# EAGLE design monitor (EAGLE 6.3)

## Sheet 1 of 4: Measure
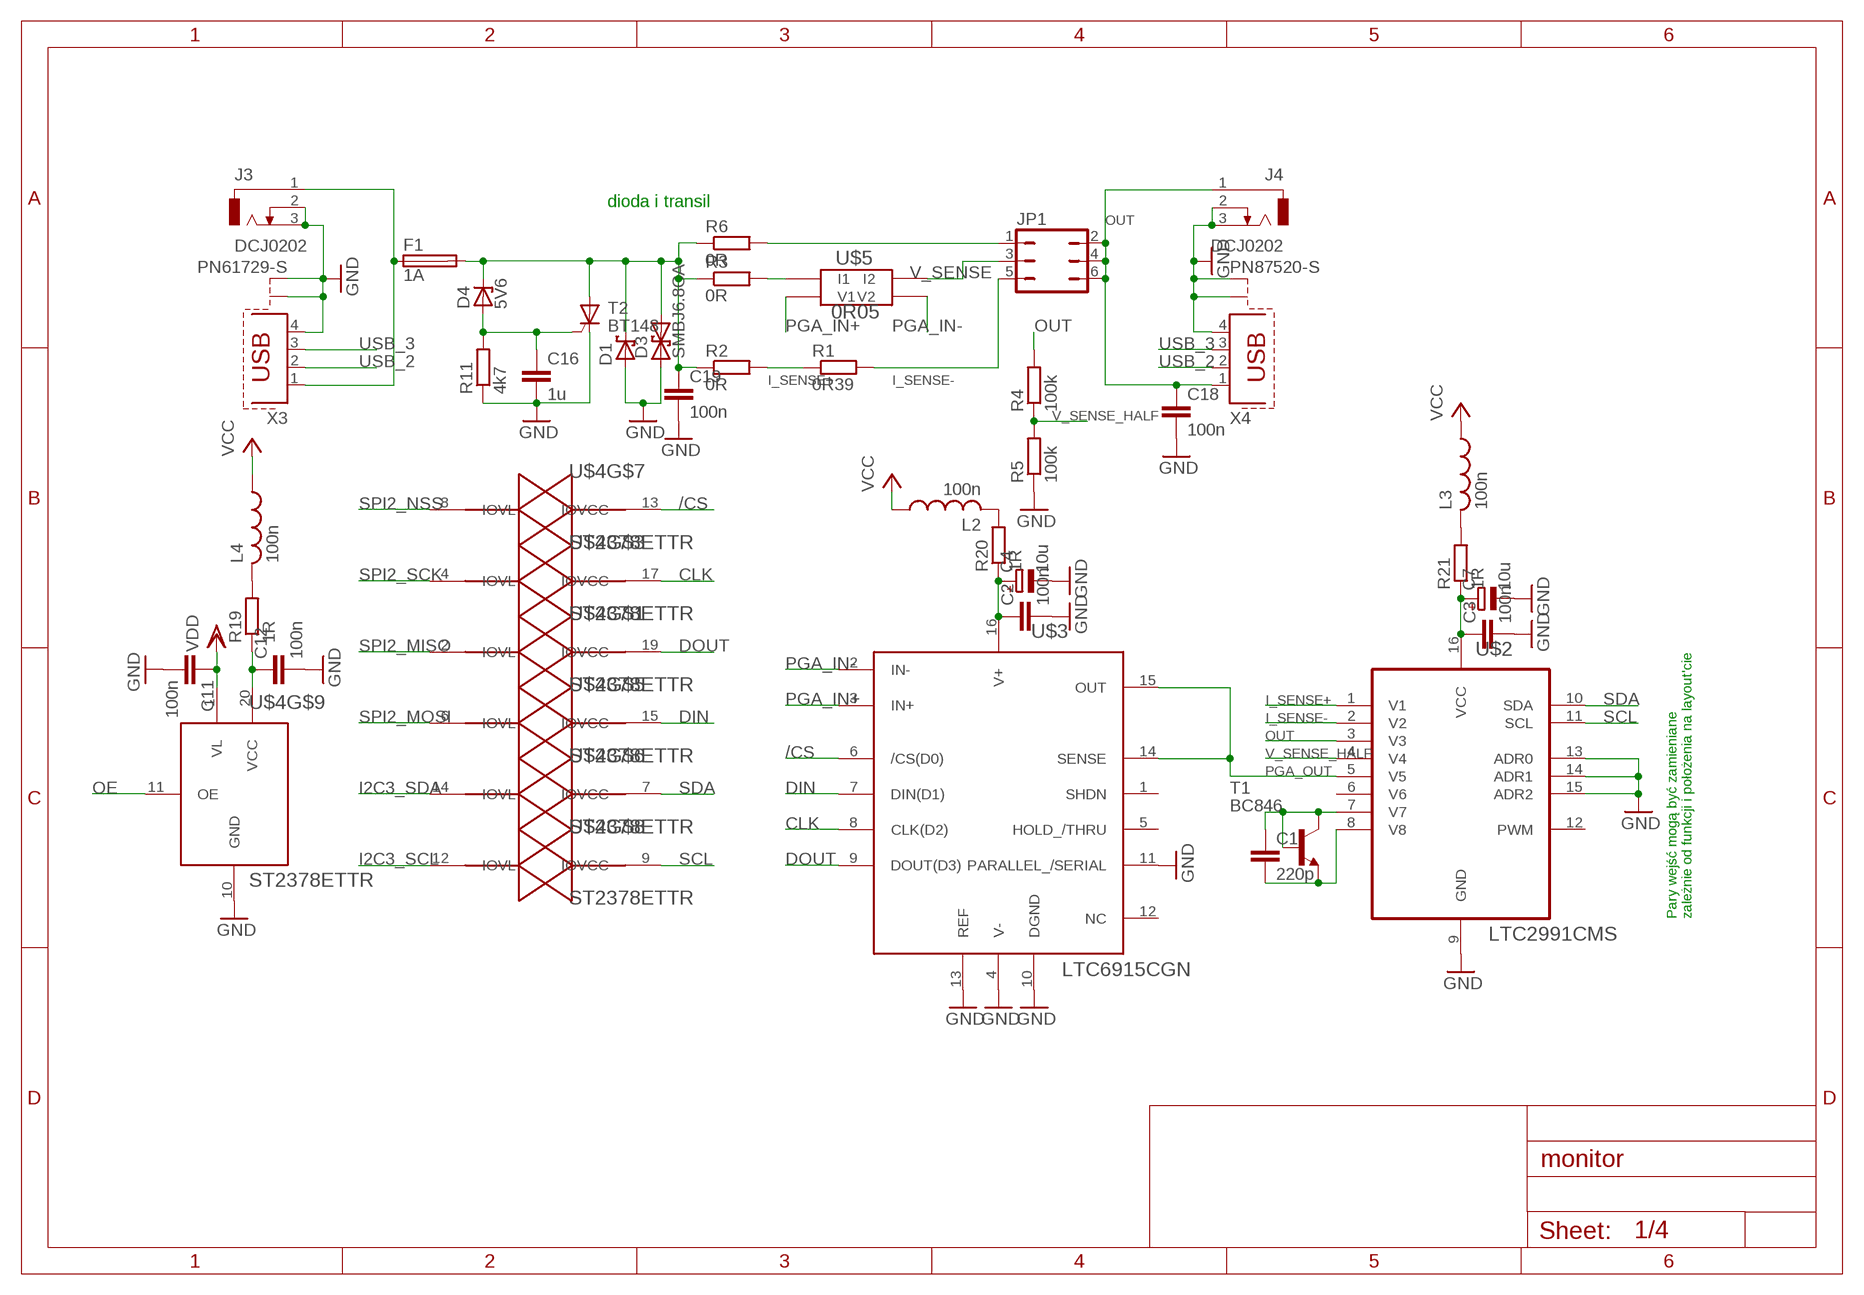
[diagram p0: schematic, sheet 1]

### Parts
C1  220p  C-EUC0805  [C0805]
C2  100n  C-EUC0603  [C0603]
C3  100n  C-EUC0603  [C0603]
C4  10u  CPOL-EUSMCA  [SMC_A]
C7  10u  CPOL-EUSMCA  [SMC_A]
C11  100n  C-EUC0603  [C0603]
C12  100n  C-EUC0603  [C0603]
C16  1u  C-EUC0805  [C0805]
C18  100n  C-EUC0603  [C0603]
C19  100n  C-EUC0603  [C0603]
D1  SCHOTTKY-DIODESMD  [SMB]
D3  SMBJ6.8CA  SMBJ  [SMB]
D4  5V6  ZENER-DIODESOD80C  [SOD80C]
F1  1A  FUSE1206  [R1206]
J3  DCJ0202  [DCJ0202]
J4  DCJ0202  [DCJ0202]
JP1  JP3Q  [JP3Q]
L2  100n  L-US  [R0603]
L3  100n  L-US  [R0603]
L4  100n  L-US  [R0603]
R1  0R39  R-EU_0207/7  [0207/7]
R2  0R  R-EU_R0805  [R0805]
R3  0R  R-EU_R0805  [R0805]
R4  100k  R-EU_R0805  [R0805]
R5  100k  R-EU_R0805  [R0805]
R6  0R  R-EU_R0805  [R0805]
R11  4k7  R-EU_R0805  [R0805]
R19  1R  R-EU_R0603  [R0603]
R20  1R  R-EU_R0603  [R0603]
R21  1R  R-EU_R0603  [R0603]
T1  BC846  [SOT23]
T2  BT148  [SOT223]
U$2  LTC2991CMS  [SOP50P490X110-16N]
U$3  LTC6915CGN  [SOP65P640X120-16N]
U$4  ST2378ETTR  [TSSOP20]
U$5  0R05  LVK12R050DER  [LVK12]
X3  PN61729-S  [PN61729-S]
X4  PN87520-S  [PN87520-S]

### Nets
/CS: U$3.6(/CS(D0)) U$4.13(IOVCC)
CLK: U$3.8(CLK(D2)) U$4.17(IOVCC)
DIN: U$3.7(DIN(D1)) U$4.15(IOVCC)
DOUT: U$3.9(DOUT(D3)) U$4.19(IOVCC)
GND: C2.2 C3.2 C4.- C7.- C11.2 C12.2 C16.2 C18.2 C19.2 D1.A D3.A J3.2 J3.3 J4.2 J4.3 R5.1 R11.1 T2.1(C) U$2.9(GND) U$2.13(ADR0) U$2.14(ADR1) U$2.15(ADR2) U$3.4(V-) U$3.10(DGND) U$3.11(PARALLEL_/SERIAL) U$3.13(REF) U$4.10(GND) X3.4 X3.S1 X3.S2 X4.4 X4.S1 X4.S2 ; also sheet 2,3,4
I2C3_SCL: U$4.12(IOVL) ; also sheet 2
I2C3_SDA: U$4.14(IOVL) ; also sheet 2
I_SENSE+: R1.1 R2.2 U$2.1(V1)
I_SENSE-: JP1.5 R1.2 U$2.2(V2)
IN: F1.1 J3.1 X3.1
N$2: R3.2 U$5.P$3(I1)
N$4: JP1.1 R6.2
N$13: C19.1 D1.C D3.C D4.C F1.2 R2.1 R3.1 R6.1 T2.2(A)
N$14: C1.1 T1.1(B) T1.3(C) U$2.7(V7)
N$15: C1.2 T1.2(E) U$2.8(V8)
N$23: C16.1 D4.A R11.2 T2.3(G)
N$27: C12.1 R19.1 U$4.20(VCC)
N$30: L4.2 R19.2
N$31: C2.1 C4.+ R20.1 U$3.16(V+)
N$32: C3.1 C7.+ R21.1 U$2.16(VCC)
N$33: L2.2 R20.2
N$35: L3.2 R21.2
OE: U$4.11(OE) ; also sheet 2
OUT: C18.1 J4.1 JP1.2 JP1.4 JP1.6 R4.2 U$2.3(V3) X4.1
PGA_IN+: U$3.3(IN+) U$5.P$4(V1)
PGA_IN-: U$3.2(IN-) U$5.P$1(V2)
PGA_OUT: U$2.5(V5) U$3.14(SENSE) U$3.15(OUT)
SCL: U$2.11(SCL) U$4.9(IOVCC)
SDA: U$2.10(SDA) U$4.7(IOVCC)
SPI2_MISO: U$4.2(IOVL) ; also sheet 2
SPI2_MOSI: U$4.6(IOVL) ; also sheet 2
SPI2_NSS: U$4.8(IOVL) ; also sheet 2
SPI2_SCK: U$4.4(IOVL) ; also sheet 2
USB_2: X3.2 X4.2
USB_3: X3.3 X4.3
V_SENSE: JP1.3 U$5.P$2(I2)
V_SENSE_HALF: R4.1 R5.2 U$2.4(V4)
VCC: L2.1 L3.1 L4.1 ; also sheet 3
VDD: C11.1 U$4.1(VL) ; also sheet 2
Unconnected: U$2.6(V6) U$2.12(PWM) U$3.1(SHDN) U$3.5(HOLD_/THRU) U$3.12(NC) U$4.3(IOVCC) U$4.5(IOVCC) U$4.16(IOVL) U$4.18(IOVL)

### Notes on the sheet
- dioda i transil
- Pary wejść mogą być zamieniane 
  zależnie od funkcji i położenia na layout'cie

## Sheet 2 of 4: Proc
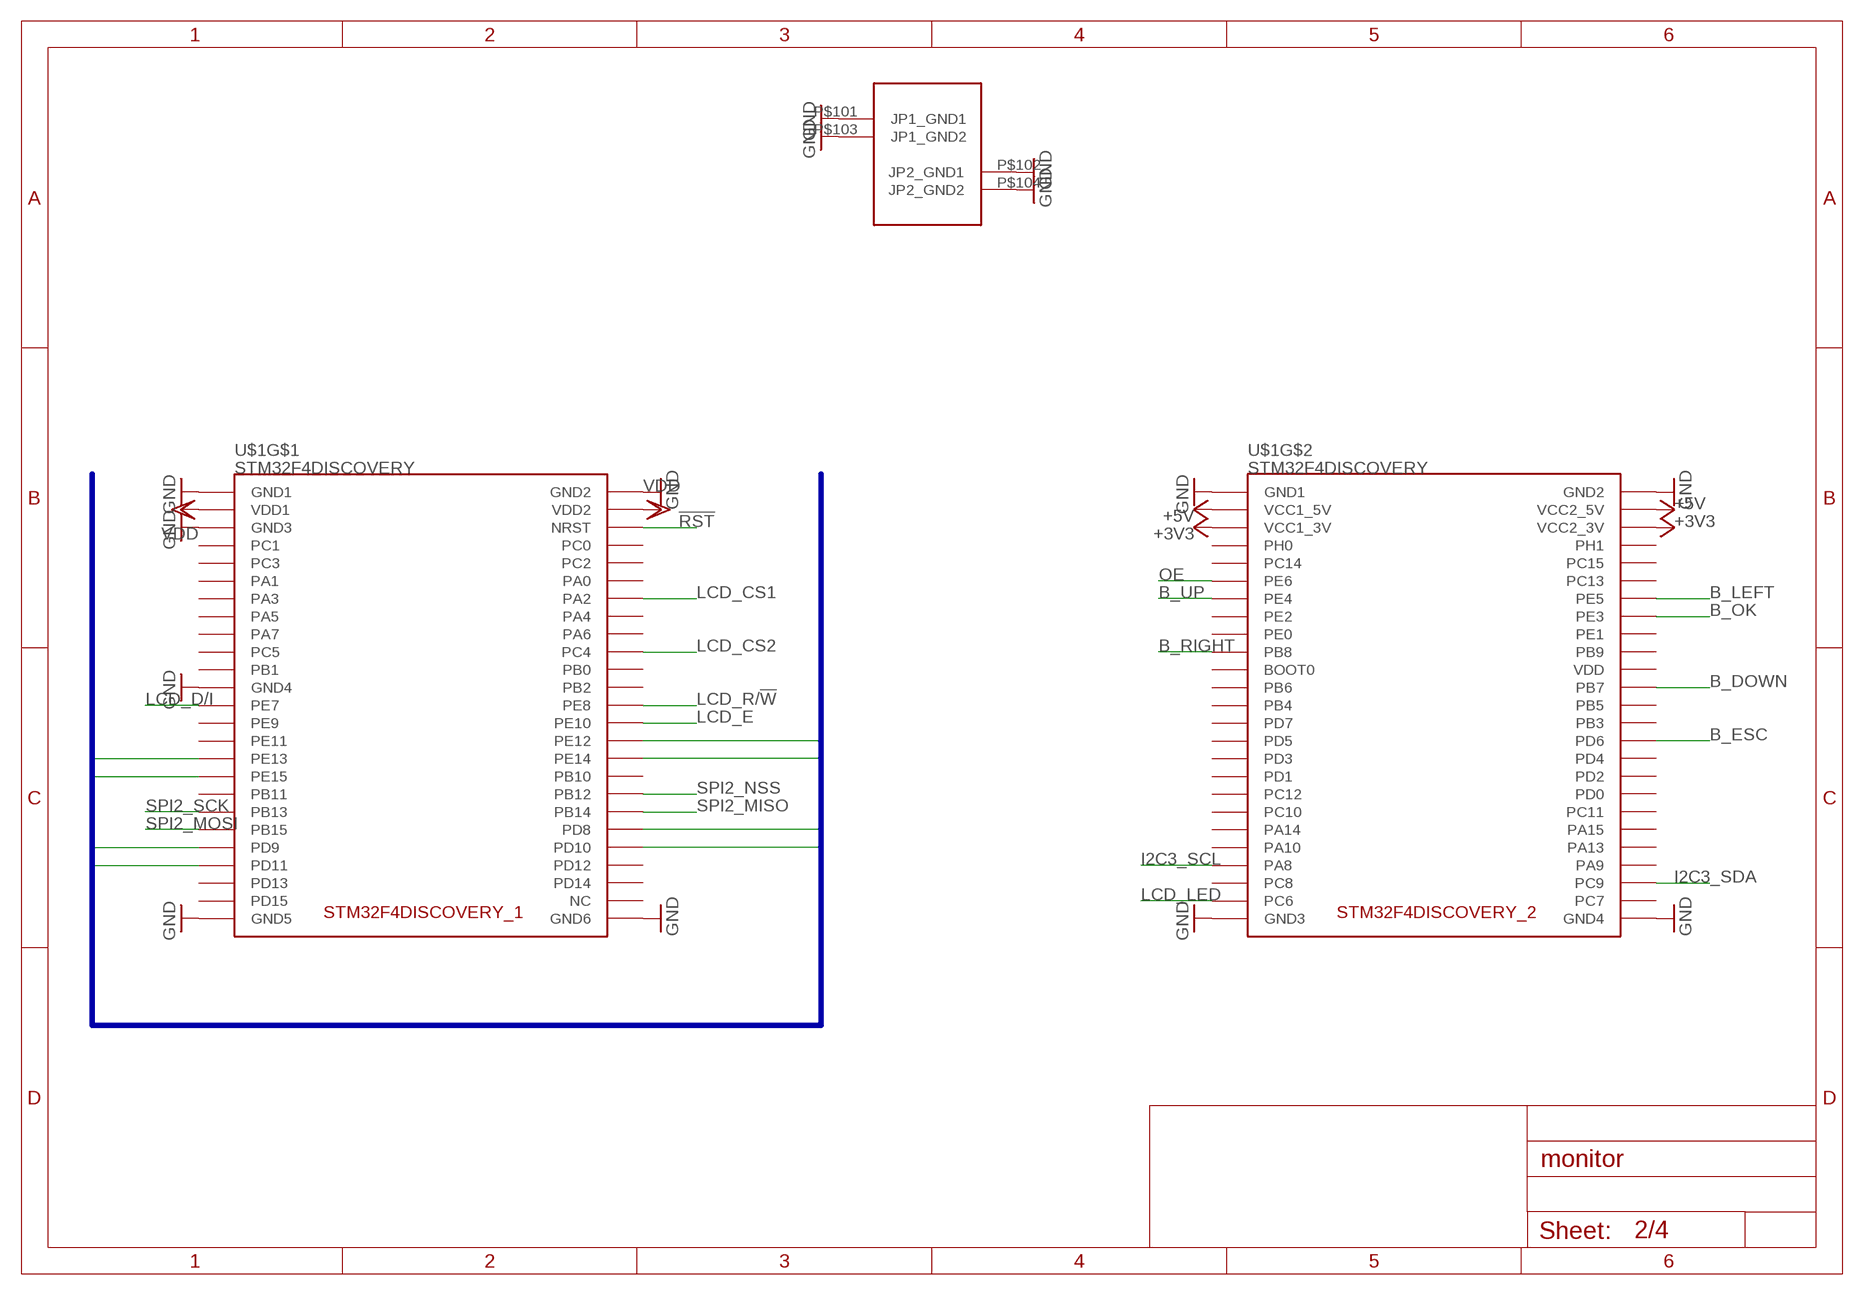
[diagram p1: schematic, sheet 2]

### Parts
U$1  STM32F4DISCOVERY  [STM32F4DISCOVERY]

### Nets
!RST: U$1.P$6(NRST) ; also sheet 4
+3V3: U$1.P$55(VCC1_3V) U$1.P$56(VCC2_3V)
+5V: U$1.P$53(VCC1_5V) U$1.P$54(VCC2_5V) ; also sheet 3,4
B_DOWN: U$1.P$74(PB7) ; also sheet 4
B_ESC: U$1.P$80(PD6) ; also sheet 4
B_LEFT: U$1.P$64(PE5) ; also sheet 4
B_OK: U$1.P$66(PE3) ; also sheet 4
B_RIGHT: U$1.P$69(PB8) ; also sheet 4
B_UP: U$1.P$63(PE4) ; also sheet 4
GND: U$1.P$1(GND1) U$1.P$2(GND2) U$1.P$5(GND3) U$1.P$23(GND4) U$1.P$49(GND5) U$1.P$50(GND6) U$1.P$51(GND1) U$1.P$52(GND2) U$1.P$99(GND3) U$1.P$100(GND4) U$1.P$101(JP1_GND1) U$1.P$102(JP2_GND1) U$1.P$103(JP1_GND2) U$1.P$104(JP2_GND2) ; also sheet 1,3,4
I2C3_SCL: U$1.P$93(PA8) ; also sheet 1
I2C3_SDA: U$1.P$96(PC9) ; also sheet 1
LCD_CS1: U$1.P$14(PA2) ; also sheet 4
LCD_CS2: U$1.P$20(PC4) ; also sheet 4
LCD_D0: U$1.P$30(PE12) ; also sheet 4
LCD_D1: U$1.P$31(PE13) ; also sheet 4
LCD_D2: U$1.P$32(PE14) ; also sheet 4
LCD_D3: U$1.P$33(PE15) ; also sheet 4
LCD_D4: U$1.P$40(PD8) ; also sheet 4
LCD_D5: U$1.P$41(PD9) ; also sheet 4
LCD_D6: U$1.P$42(PD10) ; also sheet 4
LCD_D7: U$1.P$43(PD11) ; also sheet 4
LCD_D/I: U$1.P$25(PE7) ; also sheet 4
LCD_E: U$1.P$28(PE10) ; also sheet 4
LCD_LED: U$1.P$97(PC6) ; also sheet 4
LCD_R/!W: U$1.P$26(PE8) ; also sheet 4
OE: U$1.P$61(PE6) ; also sheet 1
SPI2_MISO: U$1.P$38(PB14) ; also sheet 1
SPI2_MOSI: U$1.P$39(PB15) ; also sheet 1
SPI2_NSS: U$1.P$36(PB12) ; also sheet 1
SPI2_SCK: U$1.P$37(PB13) ; also sheet 1
VDD: U$1.P$3(VDD1) U$1.P$4(VDD2) ; also sheet 1
Unconnected: U$1.P$7(PC1) U$1.P$8(PC0) U$1.P$9(PC3) U$1.P$10(PC2) U$1.P$11(PA1) U$1.P$12(PA0) U$1.P$13(PA3) U$1.P$15(PA5) U$1.P$16(PA4) U$1.P$17(PA7) U$1.P$18(PA6) U$1.P$19(PC5) U$1.P$21(PB1) U$1.P$22(PB0) U$1.P$24(PB2) U$1.P$27(PE9) U$1.P$29(PE11) U$1.P$34(PB10) U$1.P$35(PB11) U$1.P$44(PD12) U$1.P$45(PD13) U$1.P$46(PD14) U$1.P$47(PD15) U$1.P$48(NC) U$1.P$57(PH0) U$1.P$58(PH1) U$1.P$59(PC14) U$1.P$60(PC15) U$1.P$62(PC13) U$1.P$65(PE2) U$1.P$67(PE0) U$1.P$68(PE1) U$1.P$70(PB9) U$1.P$71(BOOT0) U$1.P$72(VDD) U$1.P$73(PB6) U$1.P$75(PB4) U$1.P$76(PB5) U$1.P$77(PD7) U$1.P$78(PB3) U$1.P$79(PD5) U$1.P$81(PD3) U$1.P$82(PD4) U$1.P$83(PD1) U$1.P$84(PD2) U$1.P$85(PC12) U$1.P$86(PD0) U$1.P$87(PC10) U$1.P$88(PC11) U$1.P$89(PA14) U$1.P$90(PA15) U$1.P$91(PA10) U$1.P$92(PA13) U$1.P$94(PA9) U$1.P$95(PC8) U$1.P$98(PC7)

### Buses
LCD_D[0..7]

## Sheet 3 of 4: Supply
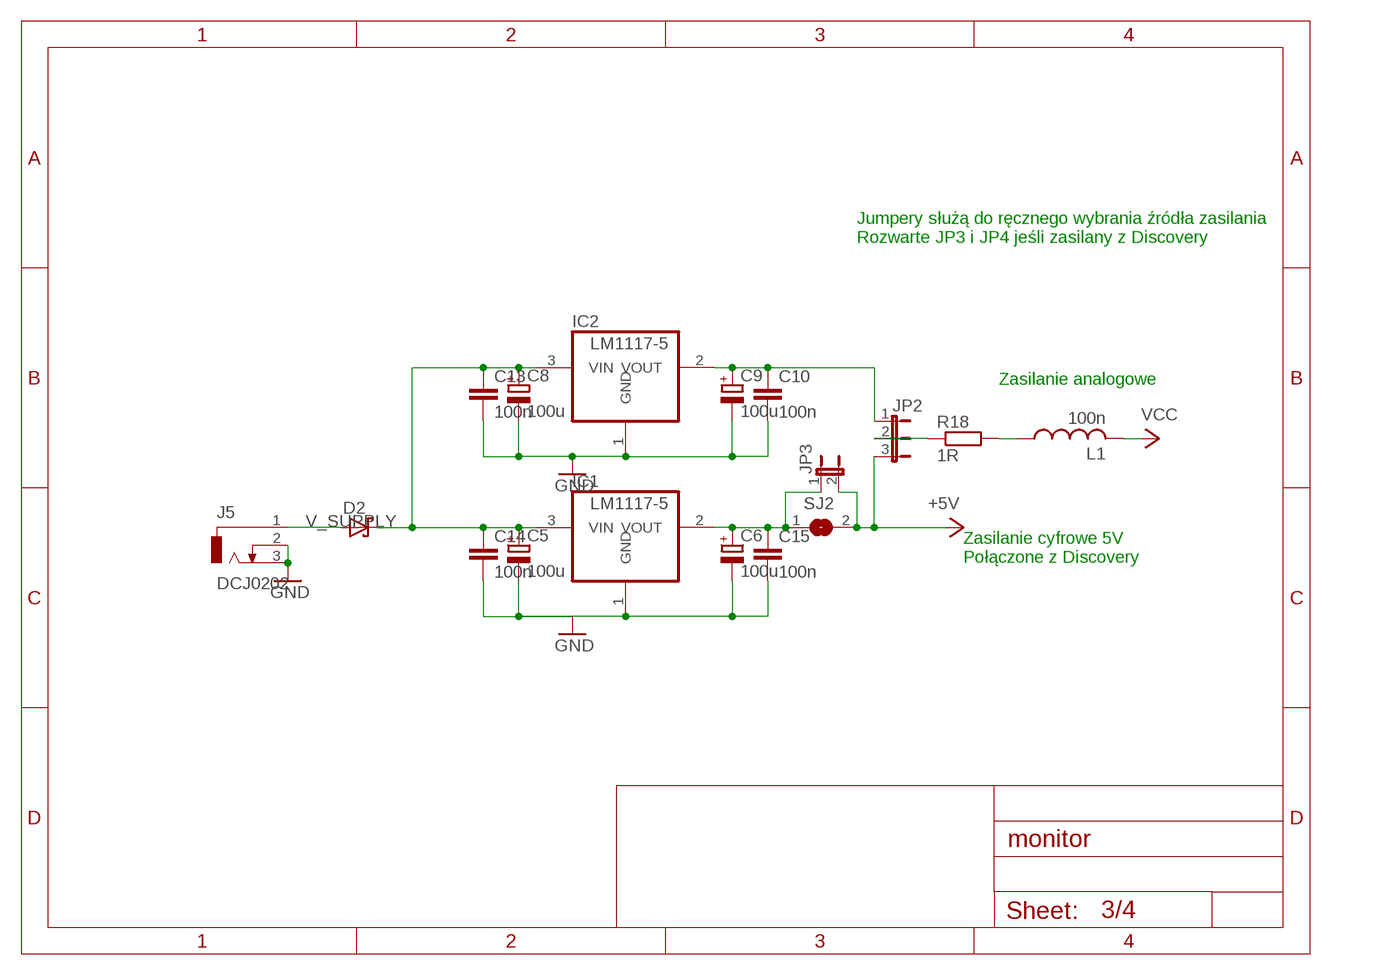
[diagram p2: schematic, sheet 3]

### Parts
C5  100u  CPOL-EUSMCB  [SMC_B]
C6  100u  CPOL-EUSMCB  [SMC_B]
C8  100u  CPOL-EUSMCB  [SMC_B]
C9  100u  CPOL-EUSMCB  [SMC_B]
C10  100n  C-EUC0603  [C0603]
C13  100n  C-EUC0603  [C0603]
C14  100n  C-EUC0603  [C0603]
C15  100n  C-EUC0603  [C0603]
D2  SCHOTTKY-DIODESMD  [SMB]
IC1  LM1117-5  REG1117  [SOT223]
IC2  LM1117-5  REG1117  [SOT223]
J5  DCJ0202  [DCJ0202]
JP2  JP2E  [JP2]
JP3  JP1E  [JP1]
L1  100n  L-US  [R0603]
R18  1R  R-EU_R0603  [R0603]
SJ2  SJ  [SJ]

### Nets
+5V: JP2.3 JP3.2 SJ2.2 ; also sheet 2,4
GND: C5.- C6.- C8.- C9.- C10.2 C13.2 C14.2 C15.2 IC1.1(GND) IC2.1(GND) J5.2 J5.3 ; also sheet 1,2,4
N$8: C6.+ C15.1 IC1.2(VOUT) JP3.1 SJ2.1
N$10: C9.+ C10.1 IC2.2(VOUT) JP2.1
N$11: D2.A J5.1
N$24: L1.1 R18.2
N$25: JP2.2 R18.1
V_SUPPLY: C5.+ C8.+ C13.1 C14.1 D2.C IC1.3(VIN) IC2.3(VIN)
VCC: L1.2 ; also sheet 1

### Notes on the sheet
- Jumpery służą do ręcznego wybrania źródła zasilania
  Rozwarte JP3 i JP4 jeśli zasilany z Discovery
- Zasilanie analogowe
- Zasilanie cyfrowe 5V
  Połączone z Discovery

## Sheet 4 of 4: User
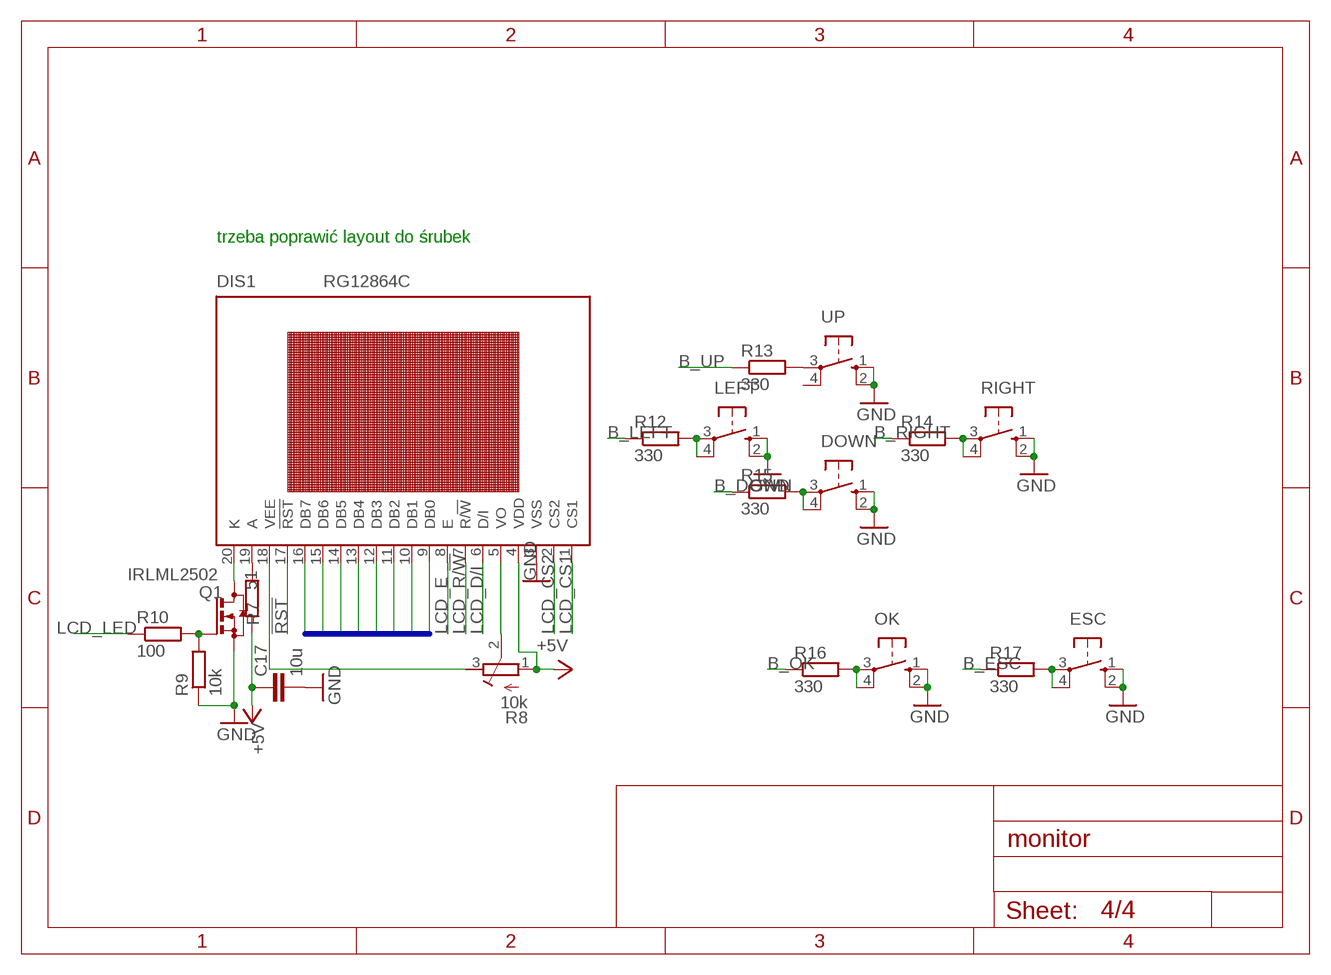
[diagram p3: schematic, sheet 4]

### Parts
C17  10u  C-EUC1206  [C1206]
DIS1  RG12864C  [RG12864C]
DOWN  40-XX  [B3F-40XX]
ESC  40-XX  [B3F-40XX]
LEFT  40-XX  [B3F-40XX]
OK  40-XX  [B3F-40XX]
Q1  IRLML2502  BSS123  [SOT23]
R7  51  R-EU_R1206  [R1206]
R8  10k  TS53YJ  [RTRIMTS53YJ]
R9  10k  R-EU_R0805  [R0805]
R10  100  R-EU_R0805  [R0805]
R12  330  R-EU_R0805  [R0805]
R13  330  R-EU_R0805  [R0805]
R14  330  R-EU_R0805  [R0805]
R15  330  R-EU_R0805  [R0805]
R16  330  R-EU_R0805  [R0805]
R17  330  R-EU_R0805  [R0805]
RIGHT  40-XX  [B3F-40XX]
UP  40-XX  [B3F-40XX]

### Nets
!RST: DIS1.17(!RST) ; also sheet 2
+5V: C17.1 DIS1.4(VDD) R7.1 R8.1(A) ; also sheet 2,3
B_DOWN: R15.1 ; also sheet 2
B_ESC: R17.1 ; also sheet 2
B_LEFT: R12.1 ; also sheet 2
B_OK: R16.1 ; also sheet 2
B_RIGHT: R14.1 ; also sheet 2
B_UP: R13.1 ; also sheet 2
GND: C17.2 DIS1.3(VSS) DOWN.1(S) DOWN.2(S1) ESC.1(S) ESC.2(S1) LEFT.1(S) LEFT.2(S1) OK.1(S) OK.2(S1) Q1.2(S) R9.1 RIGHT.1(S) RIGHT.2(S1) UP.1(S) UP.2(S1) ; also sheet 1,2,3
LCD_CS1: DIS1.1(CS1) ; also sheet 2
LCD_CS2: DIS1.2(CS2) ; also sheet 2
LCD_D0: DIS1.9(DB0) ; also sheet 2
LCD_D1: DIS1.10(DB1) ; also sheet 2
LCD_D2: DIS1.11(DB2) ; also sheet 2
LCD_D3: DIS1.12(DB3) ; also sheet 2
LCD_D4: DIS1.13(DB4) ; also sheet 2
LCD_D5: DIS1.14(DB5) ; also sheet 2
LCD_D6: DIS1.15(DB6) ; also sheet 2
LCD_D7: DIS1.16(DB7) ; also sheet 2
LCD_D/I: DIS1.6(D/I) ; also sheet 2
LCD_E: DIS1.8(E) ; also sheet 2
LCD_LED: R10.1 ; also sheet 2
LCD_R/!W: DIS1.7(R/!W) ; also sheet 2
N$1: DIS1.19(A) R7.2
N$3: DIS1.18(VEE) R8.3(E)
N$6: DIS1.5(VO) R8.2(S)
N$7: LEFT.3(P) LEFT.4(P1) R12.2
N$9: DIS1.20(K) Q1.3(D)
N$12: Q1.1(G) R9.2 R10.2
N$17: R13.2 UP.3(P)
N$18: R14.2 RIGHT.3(P) RIGHT.4(P1)
N$19: DOWN.3(P) DOWN.4(P1) R15.2
N$20: ESC.3(P) ESC.4(P1) R17.2
N$21: OK.3(P) OK.4(P1) R16.2
Unconnected: UP.4(P1)

### Buses
LCD_D[0..7]

### Notes on the sheet
- trzeba poprawić layout do śrubek

## Library data of the parts
C1-C3 C10-C19 = rcl:C-EU: CAPACITOR, European symbol
C4-C9 = rcl:CPOL-EU: POLARIZED CAPACITOR, European symbol
D1 D2 = diode:SCHOTTKY-DIODE: Schottky Diode
D3 = mgr_components:SMBJ: DIODE transient-voltage suppressor
D4 = diode:ZENER-DIODE: Z-Diode
DIS1 = mgr_components:RG12864C: RG12864C 128 X 64 Dots Graphic Source: http://www.raystar-optronics.com/; OC_FARNELL: unknown; OC_NEWARK: unknown
DOWN ESC LEFT OK RIGHT UP = switch-omron:40-XX: OMRON SWITCH; MF: OMRON COMPONENTS USA; MPN: B3F-4000; OC_FARNELL: 176434; OC_NEWARK: 36K3105
F1 = fuse:FUSE: Fuse
IC1 IC2 = burr-brown:REG1117: 800mA and 1A Low Dropout (LDO) Positive Regulator 1.8V, 2.5V, 2.85V, 3.3V, 5V, and Adj; MPN: REG1117; OC_FARNELL: 1097566; OC_NEWARK: 14P6981
J3-J5 = con-jack:DCJ0202: DC POWER JACK Source: DCJ0202.pdf; OC_FARNELL: unknown; OC_NEWARK: unknown
JP1 = jumper:JP3Q: JUMPER
JP2 = jumper:JP2E: JUMPER
JP3 = jumper:JP1E: JUMPER
L1-L4 = rcl:L-US: INDUCTOR, American symbol
Q1 = transistor-small-signal:BSS123: N-CHANNEL MOS FET
R1 = resistor:R-EU_: RESISTOR, European symbol
R2-R7 R9-R21 = rcl:R-EU_: RESISTOR, European symbol
R8 = mgr_components:TS53YJ
SJ2 = jumper:SJ: SMD solder JUMPER
T1 = transistor-neu-to92:BC846: NPN TRANSISTOR
T2 = mgr_components:BT148: THYRISTOR
U$1 = stm32f4discovery:STM32F4DISCOVERY
U$2 = mgr_components:LTC2991CMS
U$3 = mgr_components:LTC6915CGN: PGA
U$4 = mgr_components:ST2378ETTR
U$5 = mgr_components:LVK12R050DER
X3 = usb:PN61729-S: BERG USB connector; OC_FARNELL: unknown; OC_NEWARK: unknown
X4 = usb:PN87520-S; OC_FARNELL: unknown; OC_NEWARK: unknown

## Board
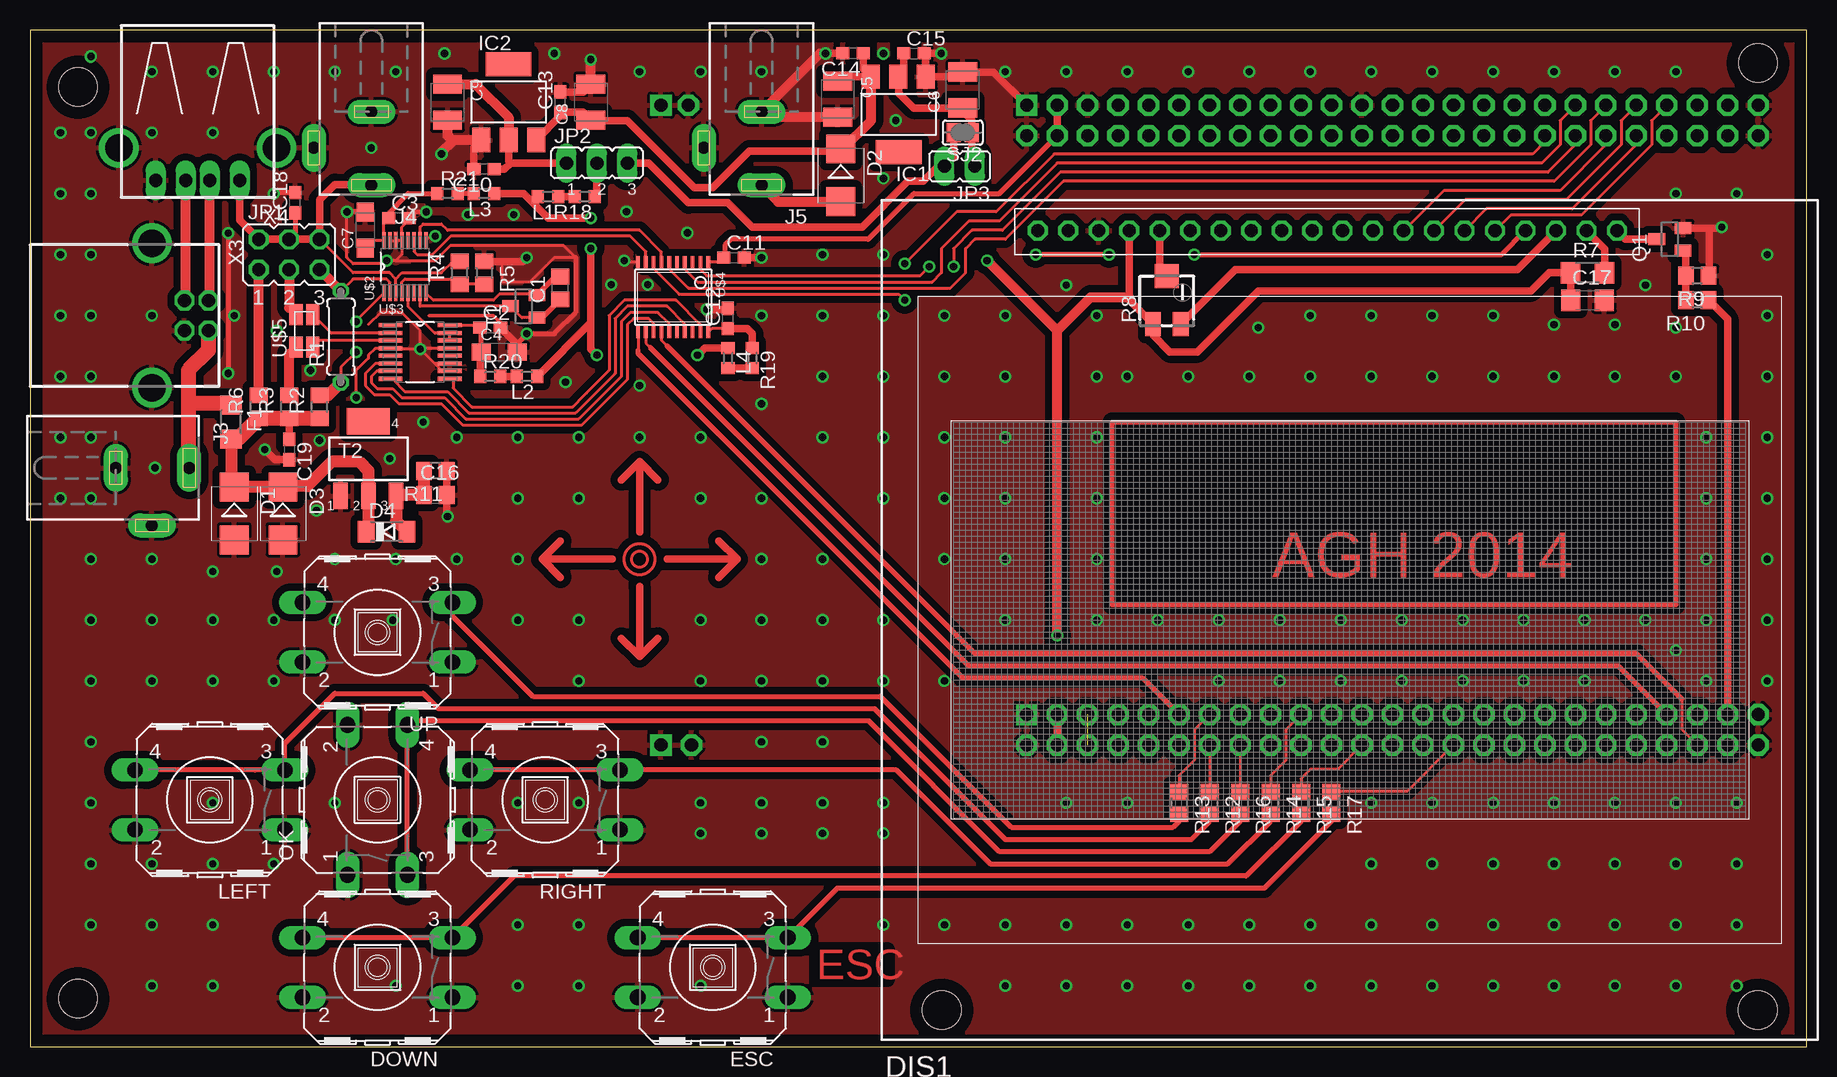
[diagram p4: board, top side]
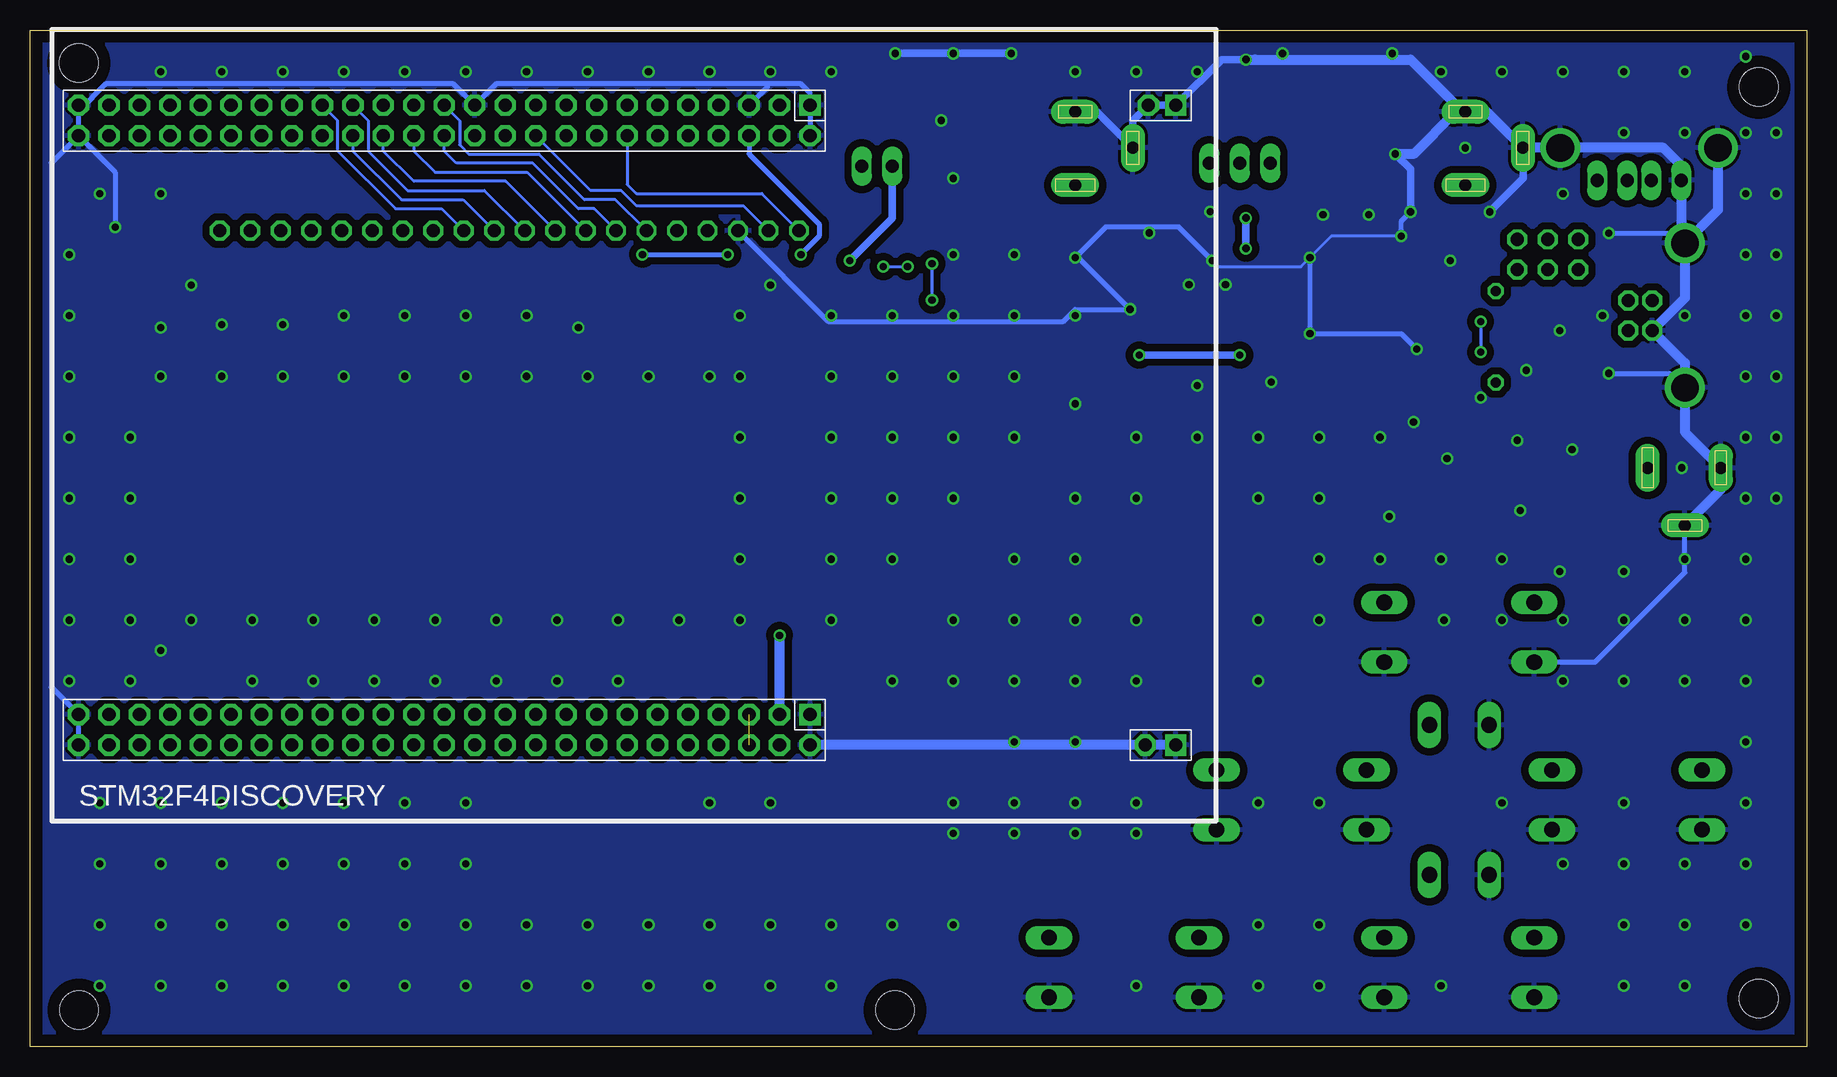
[diagram p5: board, bottom side, seen from below]

Size 148.06 x 84.76 mm. Coordinates in mm from the lower left corner, seen from the top.
Outline: 0,0 148.06,0 148.06,84.76 0,84.76 0,0
Copper layers (1*16): Top 0.035mm / dielectric 1.5mm / Bottom 0.035mm
Design rules "default *": minimum track width 10mil, minimum drill 12mil, track to track 10mil, track to pad 10mil, pad to pad 10mil, via to via 10mil, smd to smd 4mil, copper to edge 40mil, drill to drill 8mil, minimum pad ring 10mil, minimum via ring 8mil, stop-mask expansion 4mil, vias tented up to drill 0mil, thermal gap 10mil
Holes 3.2 mm at 4,80 4,4 144,82

### Footprints (pad centres in the part's own frame; a part is rotated, then mirrored left to right if it is on the bottom)
C0805 = smd 1.3 x 1.5: 1 -0.95,0; 2 0.95,0
C0603 = smd 1.1 x 1: 1 -0.85,0; 2 0.85,0
SMC_A = smd 1.6 x 1.4: + -1.5,0; - 1.5,0
SMC_B = smd 1.6 x 2.4: + -1.5,0; - 1.5,0
C1206 = smd 1.6 x 1.8: 1 -1.4,0; 2 1.4,0
SMB = smd 2.4 x 2.4: A 2.2,0; C -2.2,0
SOD80C = smd 1.4 x 1.8: A 1.7,0; C -1.7,0
RG12864C = drill 1.1 octagon: 1 -26,32.46; 2 -23.46,32.46; 3 -20.92,32.46; 4 -18.38,32.46; 5 -15.84,32.46; 6 -13.3,32.46; 7 -10.76,32.46; 8 -8.22,32.46; 9 -5.68,32.46; 10 -3.14,32.46; 11 -0.6,32.46; 12 1.94,32.46; 13 4.48,32.46; 14 7.02,32.46; 15 9.56,32.46; 16 12.1,32.46; 17 14.64,32.46; 18 17.18,32.46; 19 19.72,32.46; 20 22.26,32.46 | hole 3.2: 34,-32.5; -34,-32.5
B3F-40XX = drill 1.3 long: 1 -6.248,2.489; 2 6.248,2.489; 3 -6.248,-2.489; 4 6.248,-2.489
R1206 = smd 1.6 x 1.803: 1 -1.422,0; 2 1.422,0
SOT223 = smd 1.499 x 2.007: 1 -2.261,-3.15; 2 0.025,-3.15; 3 2.311,-3.15 | smd 3.81 x 2.007: 4 0,3.15
DCJ0202 = drill 1 pad 2 long: 1 0,3.1; 2 4.8,0; 3 0,-3
JP3Q = drill 1.1 octagon: 1 -2.54,-1.27; 2 -2.54,1.27; 3 0,-1.27; 4 0,1.27; 5 2.54,-1.27; 6 2.54,1.27
JP2 = drill 1.1 long: 1 -2.54,0; 2 0,0; 3 2.54,0
JP1 = drill 1.1 long: 1 0,-1.27; 2 0,1.27
R0603 = smd 1 x 1.1: 1 -0.85,0; 2 0.85,0
SOT23 = smd 1 x 1.4: 1 -0.95,-1.1; 2 0.95,-1.1; 3 0,1.1
0207/7 = drill 0.813 octagon: 1 -3.81,0; 2 3.81,0
R0805 = smd 1.3 x 1.5: 1 -0.95,0; 2 0.95,0
RTRIMTS53YJ = smd 1.3 x 2: 1 -1.15,-2; 3 1.15,-2 | smd 2 x 2: 2 0,2
SJ = smd 1.168 x 1.6: 1 -0.762,0; 2 0.762,0
SOT223' = smd 1.219 x 2.235: 1 -2.311,-3.099; 2 0,-3.099; 3 2.311,-3.099 | smd 3.6 x 2.2: 4 0,3.099
STM32F4DISCOVERY = drill 1.1 pad 1.778 square: P$1 0,60.96; P$51 50.8,60.96; P$101 0,91.44; P$102 53.34,91.44 | drill 1.1 pad 1.778 octagon: P$2 2.54,60.96; P$3 0,58.42; P$4 2.54,58.42; P$5 0,55.88; P$6 2.54,55.88; P$7 0,53.34; P$8 2.54,53.34; P$9 0,50.8; P$10 2.54,50.8; P$11 0,48.26; P$12 2.54,48.26; P$13 0,45.72; P$14 2.54,45.72; P$15 0,43.18; P$16 2.54,43.18; P$17 0,40.64; P$18 2.54,40.64; P$19 0,38.1; P$20 2.54,38.1; P$21 0,35.56; P$22 2.54,35.56; P$23 0,33.02; P$24 2.54,33.02; P$25 0,30.48; P$26 2.54,30.48; P$27 0,27.94; P$28 2.54,27.94; P$29 0,25.4; P$30 2.54,25.4; P$31 0,22.86; P$32 2.54,22.86; P$33 0,20.32; P$34 2.54,20.32; P$35 0,17.78; P$36 2.54,17.78; P$37 0,15.24; P$38 2.54,15.24; P$39 0,12.7; P$40 2.54,12.7; P$41 0,10.16; P$42 2.54,10.16; P$43 0,7.62; P$44 2.54,7.62; P$45 0,5.08; P$46 2.54,5.08; P$47 0,2.54; P$48 2.54,2.54; P$49 0,0; P$50 2.54,0; P$52 53.34,60.96; P$53 50.8,58.42; P$54 53.34,58.42; P$55 50.8,55.88; P$56 53.34,55.88; P$57 50.8,53.34; P$58 53.34,53.34; P$59 50.8,50.8; P$60 53.34,50.8; P$61 50.8,48.26; P$62 53.34,48.26; P$63 50.8,45.72; P$64 53.34,45.72; P$65 50.8,43.18; P$66 53.34,43.18; P$67 50.8,40.64; P$68 53.34,40.64; P$69 50.8,38.1; P$70 53.34,38.1; P$71 50.8,35.56; P$72 53.34,35.56; P$73 50.8,33.02; P$74 53.34,33.02; P$75 50.8,30.48; P$76 53.34,30.48; P$77 50.8,27.94; P$78 53.34,27.94; P$79 50.8,25.4; P$80 53.34,25.4; P$81 50.8,22.86; P$82 53.34,22.86; P$83 50.8,20.32; P$84 53.34,20.32; P$85 50.8,17.78; P$86 53.34,17.78; P$87 50.8,15.24; P$88 53.34,15.24; P$89 50.8,12.7; P$90 53.34,12.7; P$91 50.8,10.16; P$92 53.34,10.16; P$93 50.8,7.62; P$94 53.34,7.62; P$95 50.8,5.08; P$96 53.34,5.08; P$97 50.8,2.54; P$98 53.34,2.54; P$99 50.8,0; P$100 53.34,0; P$103 0,89.154; P$104 53.34,88.9
SOP50P490X110-16N = smd 1.397 x 0.279: 1 -2.184,1.753; 2 -2.184,1.245; 3 -2.184,0.762; 4 -2.184,0.254; 5 -2.184,-0.254; 6 -2.184,-0.762; 7 -2.184,-1.245; 8 -2.184,-1.753; 9 2.184,-1.753; 10 2.184,-1.245; 11 2.184,-0.762; 12 2.184,-0.254; 13 2.184,0.254; 14 2.184,0.762; 15 2.184,1.245; 16 2.184,1.753
SOP65P640X120-16N = smd 1.981 x 0.356: 1 -2.464,2.235; 2 -2.464,1.575; 3 -2.464,0.965; 4 -2.464,0.305; 5 -2.464,-0.305; 6 -2.464,-0.965; 7 -2.464,-1.575; 8 -2.464,-2.235; 9 2.464,-2.235; 10 2.464,-1.575; 11 2.464,-0.965; 12 2.464,-0.305; 13 2.464,0.305; 14 2.464,0.965; 15 2.464,1.575; 16 2.464,2.235
TSSOP20 = smd 0.305 x 0.991: 1 -2.925,-2.918; 2 -2.275,-2.918; 3 -1.625,-2.918; 4 -0.975,-2.918; 5 -0.325,-2.918; 6 0.325,-2.918; 7 0.975,-2.918; 8 1.625,-2.918; 9 2.275,-2.918; 10 2.925,-2.918; 11 2.925,2.918; 12 2.275,2.918; 13 1.625,2.918; 14 0.975,2.918; 15 0.325,2.918; 16 -0.325,2.918; 17 -0.975,2.918; 18 -1.625,2.918; 19 -2.275,2.918; 20 -2.925,2.918
LVK12 = smd 1.75 x 1.1: P$1 1.35,-0.7; P$2 1.35,0.7; P$3 -1.35,0.7; P$4 -1.35,-0.7
PN61729-S = drill 1.1 octagon: 1 1.25,4.71; 2 -1.25,4.71; 3 -1.25,2.71; 4 1.25,2.71 | drill 2.3 pad 2.9: S1 -6.02,0; S2 6.02,0
PN87520-S = drill 1.1 long: 1 -3.5,2.71; 2 -1,2.71; 3 1,2.71; 4 3.5,2.71 | drill 2.3 pad 2.9: S1 -6.57,0; S2 6.57,0

### Placement (x,y rotation side)
C1  44.2,63.25 90 top
C2  38.35,59.94 0 top
C3  30.73,69.09 0 top
C4  39.12,57.91 0 top
C5  67.31,78.99 270 top
C6  77.72,79.76 90 top
C7  27.94,68.07 90 top
C8  46.74,78.74 90 top
C9  34.8,78.74 270 top
C10  37.85,73.15 180 top
C11  58.67,65.79 0 top
C12  58.17,60.71 90 top
C13  44.2,78.74 90 top
C14  68.58,82.8 180 top
C15  73.66,82.8 0 top
C16  33.78,45.97 0 top
C17  129.79,62.23 0 top
C18  22.1,70.36 90 top
C19  21.59,49.78 270 top
D1  17.02,44.45 270 top
D2  67.56,72.64 270 top
D3  21.08,44.45 270 top
D4  29.72,42.93 0 top
DIS1  109.98,35.56 0 top
DOWN  28.96,6.6 180 top
ESC  56.9,6.6 180 top
F1  16.76,52.07 270 top
IC1  72.39,77.72 180 top
IC2  39.88,78.74 0 top
J3  10.16,48.26 270 top
J4  28.45,74.93 180 top
J5  60.96,74.93 180 top
JP1  21.59,66.04 0 top
JP2  47.24,73.66 0 top
JP3  77.47,73.41 90 top
L1  43.18,70.87 180 top
L2  41.4,55.88 180 top
L3  37.85,71.12 180 top
L4  58.17,57.4 270 top
LEFT  14.99,20.57 180 top
OK  28.96,20.57 90 top
Q1  136.65,67.31 90 top
R1  25.91,59.18 90 top
R2  24.13,53.34 90 top
R3  21.59,53.34 90 top
R4  35.81,64.52 90 top
R5  37.85,64.52 270 top
R6  19.05,53.34 90 top
R7  129.79,64.52 0 top
R8  94.74,62.23 0 top
R9  138.94,64.26 180 top
R10  138.94,62.23 180 top
R11  33.78,48.01 180 top
R12  98.3,20.32 270 top
R13  95.76,20.32 270 top
R14  103.38,20.32 270 top
R15  105.92,20.32 270 top
R16  100.84,20.32 270 top
R17  108.46,20.32 270 top
R18  46.23,70.87 180 top
R19  60.2,57.4 270 top
R20  38.35,55.88 0 top
R21  34.8,71.12 0 top
RIGHT  42.93,20.57 180 top
SJ2  77.72,76.2 180 top
T1  41.15,61.72 90 top
T2  BT148  [SOT223']  28.19,49.02 0 top
U$1  144.02,78.49 270 bottom
U$2  31.24,65.02 90 top
U$3  32.51,57.91 0 top
U$4  53.59,62.48 180 top
U$5  22.86,59.69 90 top
UP  28.96,34.54 180 top
X3  10.16,60.96 270 top
X4  13.97,74.93 180 top

### Tracks (layer width: path | path; a pad name or v marks a point on that pad's centre or on a via)
!RST  (via drill 0.6)
  Top 0.406: v97.03,66.04 122.64,66.04 DIS1.17 | v89.92,66.04 v83.82,66.04
  Bottom 0.406: U$1.P$6 88.14,74.42 82.3,68.58 82.3,67.56 v83.82,66.04 | v97.03,66.04 v89.92,66.04
+3V3  (1 unrouted)
+5V  (via drill 0.6)
  Top 0.61: R8.1 91.6,62.22 91.6,62.48 DIS1.4 | R8.1 93.59,60.83 | R8.1 93.59,59.32 95,57.91 97.28,57.91 102.36,62.99 125.07,62.99 126.59,64.52 R7.1 128.39,64.49 C17.1 | SJ2.2 76.96,74.17 JP3.2 75.69,73.41 74.42,72.14 73.15,72.14 69.34,68.33 60.2,68.33 58.17,70.36 54.86,70.36 51.56,73.66 JP2.3 | U$1.P$54 U$1.P$53
  Top 0.813: v85.6,34.29 85.6,59.69 | 85.6,59.69 v79.76,65.53 | 85.6,59.69 88.39,62.48 91.6,62.48
  Bottom 0.61: JP3.2 76.2,69.09 v79.76,65.53
  Bottom 0.813: U$1.P$53 v85.6,34.29
/CS
  Top 0.254: U$3.6 28.75,56.95 27.94,56.13 27.94,55.12 28.7,54.36 29.97,54.36 30.73,53.59 34.29,53.59 36.07,51.82 45.97,51.82 49.78,55.63 49.78,60.2 50.29,60.71 51.56,60.71 51.97,60.3 U$4.13
B_DOWN
  Top 0.254: U$1.P$74 108.97,23.11 106.68,23.11 105.92,22.35 R15.1
B_ESC
  Top 0.254: R17.1 108.52,21.34 114.81,21.34 U$1.P$80
B_LEFT
  Top 0.254: U$1.P$64 R12.1
B_OK
  Top 0.254: U$1.P$66 R16.1
B_RIGHT
  Top 0.254: U$1.P$69 104.65,26.42 104.65,23.88 103.38,22.61 R14.1
B_UP
  Top 0.254: U$1.P$63 97.03,26.42 97.03,23.88 95.76,22.61 R13.1
CLK
  Top 0.254: U$3.8 30.18,55.68 31.24,54.61 34.8,54.61 36.58,52.83 45.47,52.83 48.77,56.13 48.77,60.71 49.78,61.72 53.09,61.72 54.57,60.24 U$4.17
DIN
  Top 0.254: U$3.7 28.91,56.34 28.45,55.88 28.45,55.37 28.96,54.86 30.23,54.86 30.99,54.1 34.54,54.1 36.32,52.32 45.72,52.32 49.28,55.88 49.28,60.45 50.04,61.21 52.32,61.21 53.27,60.27 U$4.15
DOUT
  Top 0.254: U$3.9 35.26,55.68 35.26,54.91 36.83,53.34 45.21,53.34 46.23,54.36 46.35,54.48 48.26,56.39 48.26,60.96 49.53,62.23 53.85,62.23 55.87,60.21 U$4.19
GND  (via drill 0.6)
  Top 0.254: v32.51,58.17 32.46,58.22 U$3.4 28.75,58.22 28.19,57.66 28.19,57.4 27.18,56.39 v27.18,54.1 | U$3.13 32.56,58.22 v32.51,58.17 | U$3.11 33.73,56.95 | 33.73,56.95 v32.51,58.17 | U$3.10 34.34,56.34 33.73,56.95 | U$2.13 U$2.14 U$2.15 | U$2.13 30.99,68.33 31.58,68.92 C3.2 | U$2.9 33.35,67.56 v33.78,67.56 | U$4.10 49.66,65.4 v49.53,65.53 | U$2.13 30.99,66.04 30.48,65.53 | 30.48,65.53 v29.72,65.53 29.46,65.28 26.92,65.28 26.42,65.79 v26.42,69.6 | 30.48,65.53 33.78,65.53 35.05,66.8 44.45,66.8 45.47,65.79 43.69,65.79 41.66,63.75 39.37,63.75 39.37,65.53 | v32.51,58.17 32.51,59.69 30.99,61.21 29.21,61.21 28.19,60.2
  Top 0.305: 39.12,59.94 39.12,60.45 38.61,60.96 33.27,60.96
  Top 0.406: C3.2 32.09,69.6 v33.02,69.6 | C7.- 27.92,69.6 v26.42,69.6 | v16.51,67.82 v16.51,56.13 | 40.64,58.67 v41.4,59.44 43.69,59.44 45.47,61.21 45.47,65.79 | C18.2 20.41,71.21 v20.32,71.12
  Top 0.61: Q1.2 139.95,68.26 | 139.95,68.26 140.9,68.26 v140.97,68.33 | R9.1 139.95,64.33 139.95,68.26 | C14.2 v66.29,82.8 | 75.03,80.49 IC1.1 | IC1.1 74.65,82.66 C15.2 v75.95,82.8 | 77.6,80.87 IC1.1 | 40.62,58.53 C2.2 | v60.96,65.79 C11.2 | 40.39,57.91 40.64,57.91 | v34.8,44.2 34.73,44.26 C16.2 R11.1 | C8.- 46.09,79.59 C13.2 | v56.39,61.47 58.08,61.47 C12.2 | v41.4,65.79 41.08,65.47 R5.1 | C10.2 37,74.97 IC2.1 | U$1.P$1 80.29,81.26 C6.- | C19.2 20.41,48.93 v19.56,49.78
  Top 0.813: C8.- v46.74,82.3 | IC2.1 35.31,75.59 | 35.31,75.59 35.15,75.59 34.8,75.95 C9.- | v34.29,74.42 34.29,74.57 35.31,75.59 | C5.- 61.4,77.49 J5.3 65.83,82.8 v66.29,82.8
  Bottom 0.254: v49.53,65.53 49.02,65.02 42.16,65.02 v41.4,65.79 39.62,67.56 v33.78,67.56
  Bottom 0.406: v16.51,56.13 11.43,56.13 10.16,54.86 | v16.51,67.82 11.18,67.82 10.16,66.8 | U$1.P$50 140.97,72.9 v140.97,68.33 | J3.2 10.16,39.52 17.63,32.05 UP.2 | v49.53,65.53 52.32,68.33 58.42,68.33 v60.96,65.79 60.71,65.79 v56.39,61.47 60.96,61.47 61.98,60.45 81.53,60.45 89.06,67.98 DIS1.3 | U$1.P$50 144.02,77.98 | 144.02,77.98 U$1.P$49 | U$1.P$2 U$1.P$1 83.06,79.5 83.82,80.26 86.61,80.26 | 86.61,80.26 109.22,80.26 U$1.P$23 112.78,80.26 141.73,80.26 144.02,77.98 | U$1.P$5 86.61,80.01 86.61,80.26 | U$1.P$100 U$1.P$99 146.3,29.97 146.3,73.66 U$1.P$50 | v41.4,65.79 v41.4,59.44 33.78,59.44 v32.51,58.17 | v33.78,67.56 33.78,68.83 v33.02,69.6
  Bottom 0.61: J5.3 59.16,77.93 J5.2 56.16,77.19 U$1.P$103 U$1.P$101 48.77,82.3 v46.74,82.3 | v75.95,82.8 v66.29,82.8 | v26.42,69.6 23.62,72.39 23.62,74.93 | v34.29,74.42 33.02,73.15 v33.02,69.6
  Bottom 0.813: X4.S2 7.4,69.74 X3.S1 | X3.S1 10.47,67.29 X4.4 10.47,73.46 11.94,74.93 X4.S1 23.62,74.93 J4.2 26.65,77.93 J4.3 | 27.41,77.93 J4.3 | X3.S1 10.16,66.8 10.16,62.42 X3.4 10.16,57 X3.S2 10.16,54.86 10.16,51.26 J3.3 7.16,46.46 J3.2 | U$1.P$102 U$1.P$104 U$1.P$52 | 45.97,82.3 v46.74,82.3 33.02,82.3 28.45,77.72 | v34.29,74.42 32.77,74.42 29.26,77.93 J4.3
  other vias: 5.08,55.88 5.08,60.96 5.08,66.04 5.08,71.12 10.16,81.28 15.24,81.28 20.32,81.28 25.4,81.28 30.48,81.28 5.08,82.55 5.08,76.2 5.08,50.8 5.08,45.72 5.08,40.64 5.08,35.56 10.16,35.56 15.24,35.56 25.4,35.56 30.48,40.64 35.56,40.64 35.56,50.8 40.64,50.8 45.72,50.8 10.16,40.64 50.8,50.8 10.41,48.26 23.88,44.7 32.77,52.07 44.63,55.4 48.44,63.53 51.49,63.53 36.5,69.37 40.31,69.37 54.79,67.84 49.71,69.62 43.69,82.8 50.8,81.28 34.54,82.8 10.16,60.96 10.16,76.2 15.24,76.2 28.45,74.93 17.02,60.96 55.88,81.28 60.96,81.28 50.8,55.12 55.88,50.8 15.24,39.62 25.4,40.64 29.97,49.02 24.13,50.55 60.96,60.96 60.96,53.59 20.32,35.56 30.23,35.56 2.54,76.2 2.54,71.12 2.54,66.04 2.54,60.96 2.54,55.88 2.54,50.8 2.54,45.72 5.08,30.48 10.16,30.48 15.24,30.48 20.32,30.48 5.08,25.4 5.08,20.32 5.08,15.24 5.08,10.16 10.16,15.24 15.24,15.24 15.24,20.32 20.32,15.24 25.4,20.32 10.16,5.08 10.16,10.16 15.24,10.16 15.24,5.08 30.48,5.08 40.64,5.08 40.64,10.16 45.72,10.16 45.72,5.08 45.72,20.32 40.64,20.32 40.64,40.64 40.64,45.72 45.72,45.72 55.88,45.72 55.88,35.56 45.72,35.56 40.64,35.56 45.72,30.48 55.88,30.48 60.96,35.56 66.04,35.56 66.04,30.48 60.96,30.48 60.96,25.4 66.04,25.4 55.88,20.32 60.96,20.32 66.04,20.32 60.96,40.64 60.96,45.72 66.04,40.64 71.12,35.56 71.12,30.48 76.2,30.48 66.04,50.8 66.04,55.88 66.04,60.96 71.12,45.72 76.2,40.64 81.28,35.56 71.12,55.88 71.12,50.8 71.12,60.96 76.2,55.88 81.28,55.88 81.28,60.96 81.28,50.8 76.2,50.8 76.2,45.72 81.28,45.72 81.28,40.64 71.12,10.16 76.2,10.16 81.28,10.16 86.36,10.16 86.36,20.32 91.44,20.32 81.28,81.28 86.36,81.28 91.44,81.28 96.52,81.28 81.28,5.08 86.36,5.08 91.44,5.08 96.52,5.08 91.44,10.16 96.52,10.16 101.6,10.16 106.68,10.16 101.6,5.08 106.68,5.08 111.76,5.08 116.84,5.08 111.76,10.16 116.84,10.16 121.92,10.16 127,10.16 111.76,15.24 116.84,15.24 121.92,15.24 127,15.24 132.08,15.24 137.16,15.24 142.24,15.24 142.24,10.16 137.16,10.16 132.08,10.16 121.92,5.08 127,5.08 132.08,5.08 137.16,5.08 111.76,20.32 116.84,20.32 121.92,20.32 127,20.32 132.08,20.32 137.16,20.32 142.24,20.32 121.92,81.28 127,81.28 132.08,81.28 137.16,81.28 137.16,71.12 142.24,71.12 144.78,60.96 144.78,55.88 144.78,50.8 144.78,45.72 144.78,40.64 144.78,35.56 144.78,30.48 101.6,81.28 106.68,81.28 111.76,81.28 116.84,81.28 71.12,20.32 55.88,17.78 60.96,17.78 66.04,17.78 71.12,17.78 91.44,55.88 96.52,55.88 101.6,55.88 106.68,55.88 106.68,60.96 111.76,60.96 116.84,60.96 121.92,60.96 127,60.2 132.08,60.2 134.62,63.5 132.08,55.88 137.16,55.88 127,55.88 121.92,55.88 116.84,55.88 111.76,55.88 88.9,50.8 88.9,45.72 88.9,40.64 88.9,35.56 93.98,35.56 99.06,35.56 104.14,35.56 109.22,35.56 114.3,35.56 119.38,35.56 124.46,35.56 129.54,35.56 134.62,35.56 139.7,35.56 139.7,40.64 139.7,45.72 139.7,50.8 139.7,30.48 137.16,33.02 99.06,30.48 104.14,30.48 109.22,30.48 114.3,30.48 119.38,30.48 124.46,30.48 129.54,30.48 71.12,66.04 66.04,66.04 55.88,5.08 20.57,59.69 23.37,56.39 142.24,5.08 71.12,72.39 72.14,77.22 71.12,82.8 144.78,66.04 76.2,60.96 88.9,55.88 88.9,60.96 86.36,63.5 137.16,59.94 102.36,59.94 20.57,39.62
  pour Bottom (isolate 0.61): -1.02,86.36 149.86,86.36 149.86,-1.78 -1.02,-1.78
  pour Top (isolate 0.61): -0.25,85.34 148.59,85.34 148.59,-0.51 -0.25,-0.51
I2C3_SCL
  Top 0.254: U$4.12 51.32,58.66 51.69,58.29 52.58,57.4
  Top 0.406: U$1.P$93 132.33,31.75 78.23,31.75 51.69,58.29
I2C3_SDA
  Top 0.254: U$1.P$96 137.67,26.42 137.67,28.96 | U$4.14 52.62,58.89 53.09,58.42
  Top 0.406: 137.67,28.96 133.86,32.77 78.74,32.77 53.09,58.42
I_SENSE+  (via drill 0.6)
  Top 0.254: U$2.1 27.18,60.53 v27.18,60.45 | v27.18,57.91 25.91,56.64 R1.1
  Top 1.016: R1.1 24.83,54.29 R2.2
  Bottom 0.254: v27.18,60.45 v27.18,57.91
I_SENSE-
  Top 0.254: U$2.2 30,63.73 29.72,64.01 26.92,64.01 R1.2
  Top 0.813: R1.2 JP1.5
IN
  Top 1.016: F1.1 16.66,53.59
  Top 1.27: X3.1 14.87,58.05 13.21,56.39 13.21,53.59 | 13.21,53.59 13.21,48.31 J3.1 | 16.66,53.59 13.21,53.59
LCD_CS1
  Bottom 0.254: U$1.P$14 98.3,71.88 97.54,71.12 87.08,71.12 DIS1.1
LCD_CS2
  Bottom 0.254: U$1.P$20 101.35,71.37 98.81,71.37 97.54,70.1 88.61,70.1 DIS1.2
LCD_D0
  Bottom 0.254: DIS1.9 108.42,72.14 116.08,72.14 118.62,74.68 U$1.P$30
LCD_D1
  Bottom 0.254: U$1.P$31 119.89,77.22 119.89,74.68 116.59,71.37 110.2,71.37 DIS1.10
LCD_D2
  Bottom 0.254: U$1.P$32 121.16,74.68 117.09,70.61 111.97,70.61 DIS1.11
LCD_D3
  Bottom 0.254: U$1.P$33 122.43,77.22 122.43,74.68 117.6,69.85 113.75,69.85 DIS1.12
LCD_D4
  Top 0.254: U$1.P$40 131.32,75.18 127.51,71.37 117.82,71.37 DIS1.13
LCD_D5
  Top 0.254: U$1.P$41 132.59,77.22 132.59,75.18 128.02,70.61 119.59,70.61 DIS1.14
LCD_D6
  Top 0.254: U$1.P$42 133.86,75.18 128.52,69.85 121.37,69.85 DIS1.15
LCD_D7
  Top 0.254: U$1.P$43 135.13,77.22 135.13,75.18 129.29,69.34 123.4,69.34 DIS1.16
LCD_D/I
  Bottom 0.254: DIS1.6 99.27,70.61 101.85,70.61 105.66,74.42 111.51,74.42 112.27,75.18 112.27,77.22 U$1.P$25
LCD_E
  Bottom 0.254: U$1.P$28 116.08,74.68 114.3,72.9 106.64,72.9 DIS1.8
LCD_LED
  Top 0.61: U$1.P$97 141.48,60.64 R10.1
LCD_R/!W
  Bottom 0.254: U$1.P$26 113.54,74.68 112.52,73.66 106.17,73.66 102.74,70.23 102.62,70.1 102.36,69.85 101.05,69.85 DIS1.7
N$1
  Top 0.61: R7.2 131.22,66.51 DIS1.19
N$2
  Top 0.61: 21.59,57.77 U$5.P$3
  Top 0.813: R3.2 21.59,57.77
N$3
  Top 0.61: DIS1.18 127.16,67.98 123.95,64.77 100.43,64.77 R8.3
N$4
  Top 0.813: R6.2 JP1.1
N$6
  Top 0.61: R8.2 94.14,64.83 DIS1.5
N$7
  Top 0.406: R12.2 98.3,18.8 96.77,17.27 81.28,17.27 70.36,28.19 34.04,28.19 32.77,29.46 25.4,29.46 21.23,25.3 LEFT.3 | LEFT.3 LEFT.4 | LEFT.3 18.75,23.06
N$8
  Top 0.61: C15.1 72.81,81.32 IC1.2 72.39,80.85 72.39,79.5 73.64,78.26 C6.+ 77.72,78 78.49,77.24 SJ2.1 78.49,73.41 JP3.1
N$9
  Top 0.61: Q1.3 132.95,67.31 DIS1.20
N$10
  Top 0.61: 39.88,75.62 39.88,73.83 40.04,73.66 | JP2.1 40.04,73.66 | C10.1 39.54,73.15 40.04,73.66
  Top 0.813: C9.+ 37.11,80.24 39.88,77.47 39.88,75.62 IC2.2
N$11
  Top 0.813: J5.1 62.35,70.44 D2.A
N$12
  Top 0.61: 137.92,66.19 Q1.1 137.99,66.12 R9.2 R10.2
N$13
  Top 0.61: C19.1 R3.1
  Top 0.813: D1.C 16.68,46.99
  Top 1.016: 17.31,50.65 F1.2 16.76,46.9 | D4.C 28.19,43.1 T2.2 28.19,48.01 27.43,48.77 25.15,48.77 23.11,46.74 21.17,46.74 D3.C D1.C
  Top 1.27: R2.1 R3.1 R6.1 17.31,50.65 | 16.76,46.9 D1.C
N$14
  Top 0.254: T1.1 41,60.77 T1.3 32.51,61.72 32.49,61.75 U$2.7
  Top 0.406: C1.1 42.67,60.77 T1.1
N$15
  Top 0.254: T1.2 42.18,62.74 39.12,62.74 38.61,62.23 33.6,62.23 U$2.8
  Top 0.406: C1.2 43.77,64.2 T1.2
N$16
  Top 0.61: 50.8,42.93 50.8,48.77 | 50.8,48.77 52.32,47.24 | 50.8,48.77 49.28,47.24
N$17
  Top 0.406: R13.2 95.76,18.8 95.25,18.29 81.79,18.29 70.87,29.21 41.91,29.21 35.2,35.92 UP.3
N$18
  Top 0.406: R14.2 103.38,18.8 99.82,15.24 80.01,15.24 72.14,23.11 49.23,23.11 RIGHT.3 RIGHT.4
N$19
  Top 0.406: R15.2 105.92,18.8 101.35,14.22 40.34,14.22 DOWN.3 DOWN.4
N$20
  Top 0.406: R17.2 108.46,18.8 102.87,13.21 67.26,13.21 ESC.3 ESC.4
N$21
  Top 0.406: R16.2 100.84,18.8 98.3,16.26 80.77,16.26 69.85,27.18 31.8,27.18 OK.4 OK.3
N$23
  Top 1.016: D4.A 30.5,43.84 T2.3 30.56,45.97 C16.1 R11.2
N$24
  Top 0.61: R18.2 L1.1
N$25
  Top 0.406: R18.1 47.24,70.87 47.24,71.29
  Top 0.61: 47.24,71.29 JP2.2
N$26
  Top 0.61: 48.51,40.64 42.67,40.64 | 42.67,40.64 44.2,42.16 | 42.67,40.64 44.2,39.12
N$27
  Top 0.254: 56.52,59.56 U$4.20 56.81,59.86 C12.1
  Top 0.61: R19.1 60.2,59.44 59.78,59.86 C12.1
N$28
  Top 0.61: 53.09,40.64 58.93,40.64 | 58.93,40.64 57.4,39.12 | 58.93,40.64 57.4,42.16
N$29
  Top 0.61: 50.8,38.35 50.8,32.51 | 50.8,32.51 49.28,34.04 | 50.8,32.51 52.32,34.04
N$30
  Top 0.61: L4.2 R19.2
N$31
  Top 0.254: U$3.16 37.3,60.15 C2.1
  Top 0.406: C4.+ 37.62,59.83
  Top 0.61: 37.62,59.83 C2.1 | R20.1 37.5,57.8 C4.+
N$32
  Top 0.254: C3.1 29.49,68.69 U$2.16 28.58,67.21 C7.+
  Top 0.406: C3.1 29.72,69.09 29.72,69.34 31.5,71.12 R21.1
N$33
  Top 0.61: L2.2 R20.2
N$34
  Top 0.406: 90.17,52.07 137.16,52.07 137.16,36.83 90.17,36.83 90.17,52.07
N$35
  Top 0.406: L3.2 R21.2
OE
  Top 0.254: U$4.11 50.67,58.04 | 51.44,57.02 51.82,56.64
  Top 0.406: U$1.P$61 92.71,30.73 77.72,30.73 51.44,57.02 50.67,57.79 50.67,58.04
OUT
  Top 0.254: U$2.3 30.48,64.01 | 30.48,64.01 30.99,64.52 34.29,64.52 35.24,65.47 R4.2 | 30.48,64.01 29.97,64.52 26.92,64.52 JP1.6
  Top 0.406: C18.1 22.1,67.82 JP1.4
  Top 0.61: X4.1 17.47,68.89 JP1.2 JP1.4 JP1.6 24.13,70.61 25.4,71.88 28.4,71.88 J4.1
PGA_IN+
  Top 0.254: U$3.3 24.1,58.88 U$5.P$4
PGA_IN-
  Top 0.254: U$3.2 25.11,59.49 U$5.P$1
PGA_OUT
  Top 0.254: U$3.14 U$3.15 33.73,59.49 31.5,61.72 U$2.5
SCL
  Top 0.254: U$2.11 32,66.29 32.26,66.04 33.53,66.04 35.05,67.56 50.04,67.56 51.32,66.28 U$4.9
SDA
  Top 0.254: U$2.10 32.51,67.23 32.51,68.33 32.77,68.58 34.29,68.58 34.8,68.07 50.8,68.07 52.62,66.25 U$4.7
SPI2_MISO  (via drill 0.6)
  Top 0.254: U$1.P$38 128.78,75.18 126.49,72.9 85.85,72.9 81.03,68.07 78.49,68.07 76.96,66.55 v76.96,65.02 | U$4.2 55.87,65.29 55.88,65.28 55.88,64.77 56.39,64.26 74.17,64.26 v74.93,65.02
  Bottom 0.254: v76.96,65.02 v74.93,65.02
SPI2_MOSI
  Top 0.254: U$1.P$39 130.05,77.22 130.05,75.18 127,72.14 86.11,72.14 81.28,67.31 78.74,67.31 77.98,66.55 77.98,64.52 76.71,63.25 54.86,63.25 53.27,64.84 U$4.6
SPI2_NSS  (via drill 0.6)
  Top 0.254: U$1.P$36 126.24,75.44 125.22,74.42 85.34,74.42 80.52,69.6 77.22,69.6 v72.9,65.28 | U$4.8 51.97,64.87 54.1,62.74 72.39,62.74 v72.9,62.23
  Bottom 0.254: v72.9,65.28 v72.9,62.23
SPI2_SCK
  Top 0.254: U$1.P$37 127.51,77.22 127.51,75.18 125.98,73.66 85.6,73.66 80.77,68.83 78.23,68.83 75.95,66.55 75.95,64.52 75.18,63.75 55.63,63.75 54.57,64.81 U$4.4
USB_2
  Top 0.813: X3.2 14.97,62.31 X4.2
USB_3
  Top 0.813: X3.3 12.97,62.31 X4.3
V_SENSE
  Top 0.61: 21.59,61.61 U$5.P$2
  Top 0.813: JP1.3 21.59,61.61
V_SENSE_HALF
  Top 0.254: R5.2 R4.1 35.37,64.01 31.24,64.01 30.99,63.75 U$2.4
V_SUPPLY
  Top 0.61: C14.1 69.43,81.52 IC1.3 67.69,80.87 C5.+ | 67.4,74.68 59.94,74.68 56.9,71.63 55.37,71.63 49.78,77.22 46.76,77.22 C8.+ 46.09,77.89 C13.1 44.2,77.6 IC2.3
  Top 0.813: IC1.3 70.1,80.85 70.1,77.22 67.73,74.84 D2.C 67.4,74.68
VCC  (via drill 0.6)
  Top 0.61: L3.1 41.15,71.12 41.78,70.48 | v46.74,69.09 43.18,69.09 41.78,70.48 | v46.74,66.55 46.74,60.36 | 46.74,60.36 L2.1 | 57.75,58.25 L4.1 56.22,58.25 v55.63,57.66 | v47.24,57.66 46.74,58.17 46.74,60.36 | L1.2 41.95,70.48 41.78,70.48
  Bottom 0.61: v46.74,69.09 v46.74,66.55 | v47.24,57.66 v55.63,57.66
VDD
  Top 0.254: C11.1 57.44,65.4 U$4.1
  Top 0.406: U$1.P$4 80.77,71.12 73.66,71.12 69.85,67.31 58.42,67.31 57.91,66.8 57.91,65.87 C11.1
  Top 0.61: U$1.P$4 U$1.P$3
(copper drawn outside any net)
  shapes: Top circle x2

### Text on the board
Top: AGH 2014 | ESC